# Altium schematic sheet uC.SchDoc
size A3; SheetNumber: 2; SheetTotal: 4
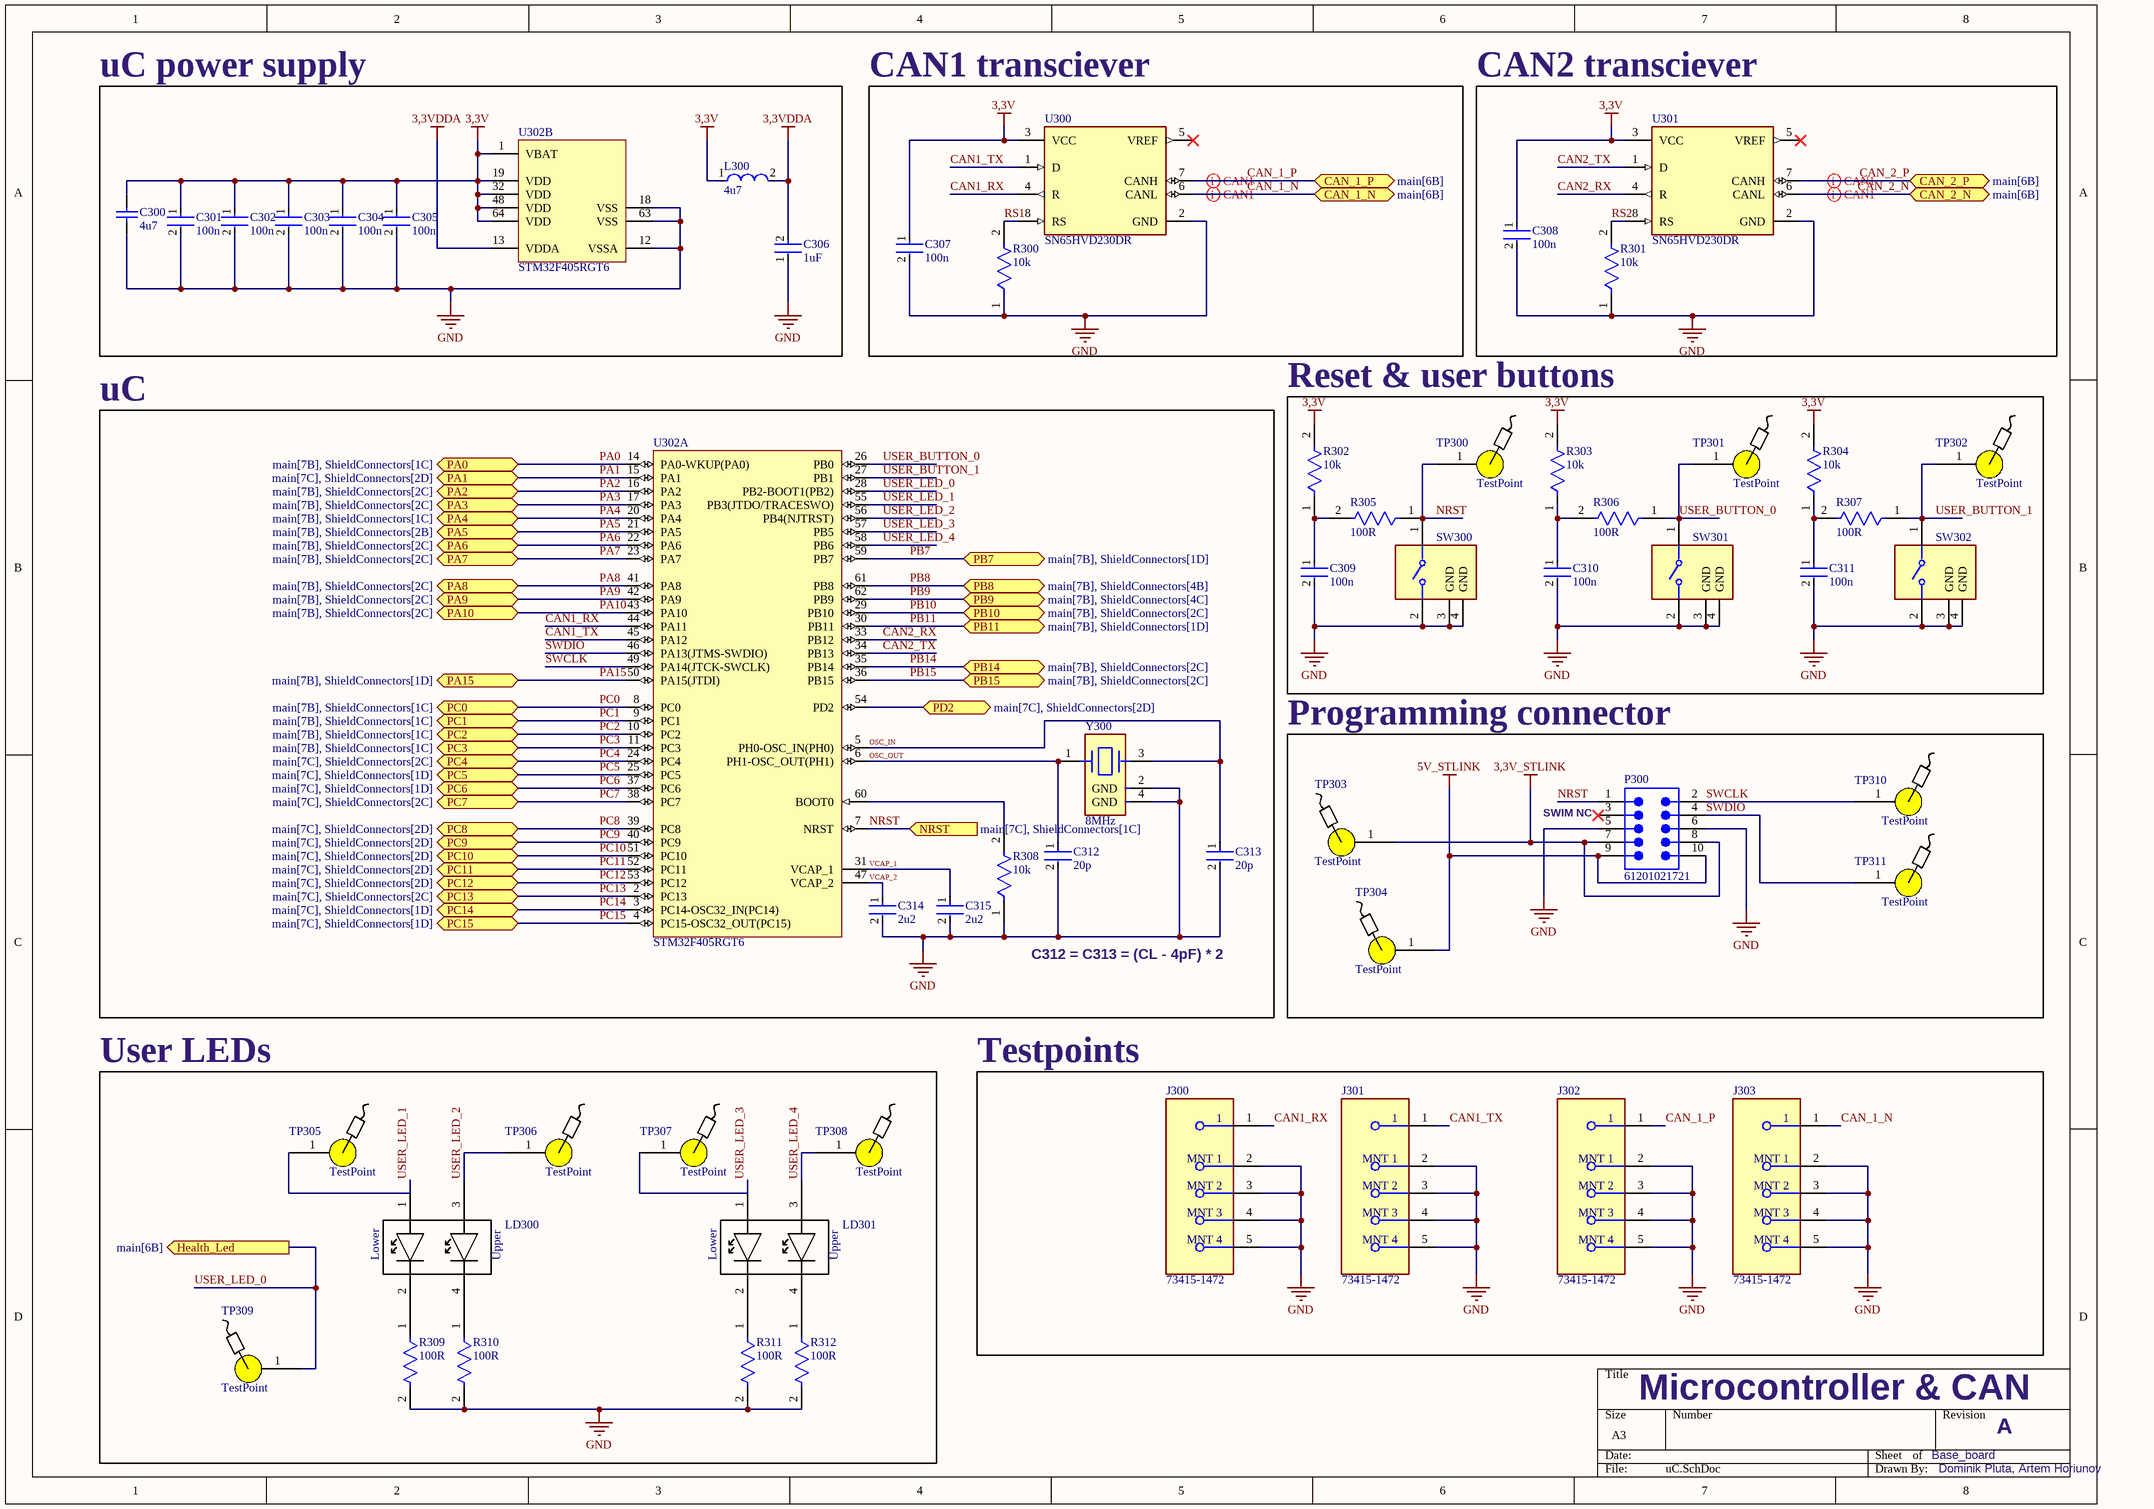
[diagram p0: uC.SchDoc]

## Parts
C300  4u7  [CAPC1608X87X35NL15T15]
C301  100n  [FP-C0603C-CF-MFG]
C302  100n  [FP-C0603C-CF-MFG]
C303  100n  [FP-C0603C-CF-MFG]
C304  100n  [FP-C0603C-CF-MFG]
C305  100n  [FP-C0603C-CF-MFG]
C306  1uF  [FP-C1608-080-0_1-IPC_B]
C307  100n  [FP-C0603C-CF-MFG]
C308  100n  [FP-C0603C-CF-MFG]
C309  100n  [FP-C0603C-CF-MFG]
C310  100n  [FP-C0603C-CF-MFG]
C311  100n  [FP-C0603C-CF-MFG]
C312  20p  [FP-C0603C-CF-MFG]
C313  20p  [FP-C0603C-CF-MFG]
C314  2u2  [FP-GRM188-0_1-e0_2_0_5-MFG]
C315  2u2  [FP-GRM188-0_1-e0_2_0_5-MFG]
J300  73415-1472  [FP-73415-1472-MFG]
J301  73415-1472  [FP-73415-1472-MFG]
J302  73415-1472  [FP-73415-1472-MFG]
J303  73415-1472  [FP-73415-1472-MFG]
L300  4u7  [FP-LQM21DH_70-IPC_C]
LD300  (no value)  [LED_HOLDER]
LD301  (no value)  [LED_HOLDER]
P300  61201021721  [61201021721]
R300  10k  [FP-RC0603-0_55-IPC_C]
R301  10k  [FP-RC0603-0_55-IPC_C]
R302  10k  [FP-RC0603-0_55-IPC_C]
R303  10k  [FP-RC0603-0_55-IPC_C]
R304  10k  [FP-RC0603-0_55-IPC_C]
R305  100R  [FP-RC0603-0_55-MFG]
R306  100R  [FP-RC0603-0_55-MFG]
R307  100R  [FP-RC0603-0_55-MFG]
R308  10k  [FP-RC0603-0_55-IPC_C]
R309  100R  [FP-RC0603-0_55-MFG]
R310  100R  [FP-RC0603-0_55-MFG]
R311  100R  [FP-RC0603-0_55-MFG]
R312  100R  [FP-RC0603-0_55-MFG]
SW300  B3F-3122  [FP-B3F-3122-MFG]  (value not drawn)
SW301  B3F-3122  [FP-B3F-3122-MFG]  (value not drawn)
SW302  B3F-3122  [FP-B3F-3122-MFG]  (value not drawn)
TP300  TestPoint  [TestPoint]  (no BOM)
TP301  TestPoint  [TestPoint]  (no BOM)
TP302  TestPoint  [TestPoint]  (no BOM)
TP303  TestPoint  [TestPoint]  (no BOM)
TP304  TestPoint  [TestPoint]  (no BOM)
TP305  TestPoint  [TestPoint]  (no BOM)
TP306  TestPoint  [TestPoint]  (no BOM)
TP307  TestPoint  [TestPoint]  (no BOM)
TP308  TestPoint  [TestPoint]  (no BOM)
TP309  TestPoint  [TestPoint]  (no BOM)
TP310  TestPoint  [TestPoint]  (no BOM)
TP311  TestPoint  [TestPoint]  (no BOM)
U300  SN65HVD230DR  [FP-D0008A-IPC_A]
U301  SN65HVD230DR  [FP-D0008A-IPC_A]
U302  STM32F405RGT6  [STM-LQFP64_M]  (parts A,B of 2)
Y300  8MHz  [FP-7M-MFG]

## Blocks framed on the sheet
uC power supply: C300-C306 L300 U302
CAN1 transciever: C307 R300 U300
CAN2 transciever: C308 R301 U301
uC: C312-C315 R308 U302 Y300
Reset & user buttons: C309-C311 R302-R307 SW300-SW302 TP300-TP302
Programming connector: P300 TP303 TP304 TP310 TP311
User LEDs: LD300 LD301 R309-R312 TP305-TP309
Testpoints: J300-J303

## Ports
CAN_1_N (bidir, see main[6B]), CAN_1_P (bidir, see main[6B]), CAN_2_N (bidir, see main[6B]), CAN_2_P (bidir, see main[6B]), Health_Led (out, see main[6B]), NRST (in, see main[7C], ShieldConnectors[1C]), PA0 (bidir, see main[7B], ShieldConnectors[1C]), PA1 (bidir, see main[7C], ShieldConnectors[2D]), PA2 (bidir, see main[7B], ShieldConnectors[2C]), PA3 (bidir, see main[7B], ShieldConnectors[2C]), PA4 (bidir, see main[7B], ShieldConnectors[1C]), PA5 (bidir, see main[7B], ShieldConnectors[2B]), PA6 (bidir, see main[7B], ShieldConnectors[2C]), PA7 (bidir, see main[7B], ShieldConnectors[2C]), PA8 (bidir, see main[7B], ShieldConnectors[2C]), PA9 (bidir, see main[7B], ShieldConnectors[2C]), PA10 (bidir, see main[7B], ShieldConnectors[2C]), PA15 (bidir, see main[7B], ShieldConnectors[1D]), PB7 (bidir, see main[7B], ShieldConnectors[1D]), PB8 (bidir, see main[7B], ShieldConnectors[4B]), PB9 (bidir, see main[7B], ShieldConnectors[4C]), PB10 (bidir, see main[7B], ShieldConnectors[2C]), PB11 (bidir, see main[7B], ShieldConnectors[1D]), PB14 (bidir, see main[7B], ShieldConnectors[2C]), PB15 (bidir, see main[7B], ShieldConnectors[2C]), PC0 (bidir, see main[7B], ShieldConnectors[1C]), PC1 (bidir, see main[7B], ShieldConnectors[1C]), PC2 (bidir, see main[7B], ShieldConnectors[1C]), PC3 (bidir, see main[7B], ShieldConnectors[1C]), PC4 (bidir, see main[7C], ShieldConnectors[2C]), PC5 (bidir, see main[7C], ShieldConnectors[1D]), PC6 (bidir, see main[7C], ShieldConnectors[1D]), PC7 (bidir, see main[7C], ShieldConnectors[2C]), PC8 (bidir, see main[7C], ShieldConnectors[2D]), PC9 (bidir, see main[7C], ShieldConnectors[2D]), PC10 (bidir, see main[7C], ShieldConnectors[2D]), PC11 (bidir, see main[7C], ShieldConnectors[2D]), PC12 (bidir, see main[7C], ShieldConnectors[2D]), PC13 (bidir, see main[7C], ShieldConnectors[2C]), PC14 (bidir, see main[7C], ShieldConnectors[1D]), PC15 (bidir, see main[7C], ShieldConnectors[1D]), PD2 (bidir, see main[7C], ShieldConnectors[2D])

## Nets
3,3V: C300.2 C301.1 C302.1 C303.1 C304.1 C305.1 C307.1 C308.1 L300.1 R302.2 R303.2 R304.2 U300.3(VCC) U301.3(VCC) U302.1(VBAT) U302.19(VDD) U302.32(VDD) U302.48(VDD) U302.64(VDD)
3,3V_STLINK: P300.7 P300.8 TP303.1
3,3VDDA: C306.2 L300.2 U302.13(VDDA)
5V_STLINK: P300.9 P300.10 TP304.1
GND: C300.1 C301.2 C302.2 C303.2 C304.2 C305.2 C306.1 C307.2 C308.2 C309.2 C310.2 C311.2 C312.2 C313.2 C314.2 C315.2 J300.2(MNT_1) J300.3(MNT_2) J300.4(MNT_3) J300.5(MNT_4) J301.2(MNT_1) J301.3(MNT_2) J301.4(MNT_3) J301.5(MNT_4) J302.2(MNT_1) J302.3(MNT_2) J302.4(MNT_3) J302.5(MNT_4) J303.2(MNT_1) J303.3(MNT_2) J303.4(MNT_3) J303.5(MNT_4) P300.5 P300.6 R300.1 R301.1 R308.1 R309.2 R310.2 R311.2 R312.2 SW300.2 SW300.3(GND) SW300.4(GND) SW301.2 SW301.3(GND) SW301.4(GND) SW302.2 SW302.3(GND) SW302.4(GND) U300.2(GND) U301.2(GND) U302.12(VSSA) U302.18(VSS) U302.63(VSS) Y300.2(GND) Y300.4(GND)
CAN1_RX: J300.1 U300.4(R) U302.44(PA11)
CAN1_TX: J301.1 U300.1(D) U302.45(PA12)
CAN2_RX: U301.4(R) U302.33(PB12)
CAN2_TX: U301.1(D) U302.34(PB13)
CAN_1_N: J303.1 U300.6(CANL) ; port CAN_1_N
CAN_1_P: J302.1 U300.7(CANH) ; port CAN_1_P
CAN_2_N: U301.6(CANL) ; port CAN_2_N
CAN_2_P: U301.7(CANH) ; port CAN_2_P
NRST: P300.1 R305.1 SW300.1 TP300.1 U302.7(NRST) ; port NRST
OSC_IN: C313.1 U302.5(PH0-OSC_IN(PH0)) Y300.3
OSC_OUT: C312.1 U302.6(PH1-OSC_OUT(PH1)) Y300.1
PA0: U302.14(PA0-WKUP(PA0)) ; port PA0
PA1: U302.15(PA1) ; port PA1
PA2: U302.16(PA2) ; port PA2
PA3: U302.17(PA3) ; port PA3
PA4: U302.20(PA4) ; port PA4
PA5: U302.21(PA5) ; port PA5
PA6: U302.22(PA6) ; port PA6
PA7: U302.23(PA7) ; port PA7
PA8: U302.41(PA8) ; port PA8
PA9: U302.42(PA9) ; port PA9
PA10: U302.43(PA10) ; port PA10
PA15: U302.50(PA15(JTDI)) ; port PA15
PB7: U302.59(PB7) ; port PB7
PB8: U302.61(PB8) ; port PB8
PB9: U302.62(PB9) ; port PB9
PB10: U302.29(PB10) ; port PB10
PB11: U302.30(PB11) ; port PB11
PB14: U302.35(PB14) ; port PB14
PB15: U302.36(PB15) ; port PB15
PC0: U302.8(PC0) ; port PC0
PC1: U302.9(PC1) ; port PC1
PC2: U302.10(PC2) ; port PC2
PC3: U302.11(PC3) ; port PC3
PC4: U302.24(PC4) ; port PC4
PC5: U302.25(PC5) ; port PC5
PC6: U302.37(PC6) ; port PC6
PC7: U302.38(PC7) ; port PC7
PC8: U302.39(PC8) ; port PC8
PC9: U302.40(PC9) ; port PC9
PC10: U302.51(PC10) ; port PC10
PC11: U302.52(PC11) ; port PC11
PC12: U302.53(PC12) ; port PC12
PC13: U302.2(PC13) ; port PC13
PC14: U302.3(PC14-OSC32_IN(PC14)) ; port PC14
PC15: U302.4(PC15-OSC32_OUT(PC15)) ; port PC15
PD2: U302.54(PD2) ; port PD2
RS1: R300.2 U300.8(RS)
RS2: R301.2 U301.8(RS)
SWCLK: P300.2 TP310.1 U302.49(PA14(JTCK-SWCLK))
SWDIO: P300.4 TP311.1 U302.46(PA13(JTMS-SWDIO))
USER_BUTTON_0: R306.1 SW301.1 TP301.1 U302.26(PB0)
USER_BUTTON_1: R307.1 SW302.1 TP302.1 U302.27(PB1)
USER_LED_0: TP309.1 U302.28(PB2-BOOT1(PB2)) ; port Health_Led
USER_LED_1: LD300.1 TP305.1 U302.55(PB3(JTDO/TRACESWO))
USER_LED_2: LD300.3 TP306.1 U302.56(PB4(NJTRST))
USER_LED_3: LD301.1 TP307.1 U302.57(PB5)
USER_LED_4: LD301.3 TP308.1 U302.58(PB6)
VCAP_1: C315.1 U302.31(VCAP_1)
VCAP_2: C314.1 U302.47(VCAP_2)
NetC309_1: C309.1 R302.1 R305.2
NetC310_1: C310.1 R303.1 R306.2
NetC311_1: C311.1 R304.1 R307.2
NetLD300_2: LD300.2 R309.1
NetLD300_4: LD300.4 R310.1
NetLD301_2: LD301.2 R311.1
NetLD301_4: LD301.4 R312.1
NetR308_2: R308.2 U302.60(BOOT0)

Not connected (* = marked no-connect by the designer): P300 3*; U300 5(VREF)*; U301 5(VREF)*

## Layout directives
differential pair: CAN_1_N, CAN_1_P, CAN_2_N, CAN_2_P

## Notes on the sheet
- (near P300) SWIM NC
- C312 = C313 = (CL - 4pF) * 2
- Microcontroller & CAN
- Base_board
- A
- Dominik Pluta, Artem Horiunov
- (in symbol DoubleStack_Side_Led_3mm) Lower; Upper

## Library data of the parts
C300 = CMP-2006-03238-1: Part Number: C0603C475K8PACTU; Manufacturer: Kemet
C301-C305 C307-C311 = CMP-2006-03061-2: CAP CER 0.1UF 50V X7R 0603; Manufacturer: KEMET; Manufacturer Part Number: C0603C104K5RACTU; Tolerance: 0.1; Temperature Coefficient: 30ppm/°C; Material: Ceramic; Automotive Grade: Grade 1; Value: 0.10 μF; Temperature: -55°C to +125°C; RoHS: TRUE; Temperature Range High: +125°C; Lead Free: Yes; Octopart: https://octopart.com/c0603c104k5ractu-kemet-139244; Digikey Description: CAP CER 0.1UF 50V X7R 0603; Category: Cap; Package: C0603C-CF; ComponentLink2Description: Datasheet; Temperature Range Low: -55°C; Device Class L1: Passive Components; Voltage Rating: 50 V; Automotive: Yes; Device Class L3: Ceramic Capacitors; ComponentLink2URL: https://api.kemet.com/component-edge/download/datasheet/C0603C100J5GACAUTO.pdf; Capacitance: 0.10 μF; Device Class L2: Capacitors; Temperature Characteristic: X7R; Height: 0.87mm
C306 = CMP-2000-06025-2: Multilayer Ceramic Capacitors 1μF ±10% 50V X5R SMD 0603; Lead Free: Lead Free; Height: 0.8mm; Mount: Surface Mount; Radiation Hardening: No; Thickness: 0.035inch; Length: 1.6mm; Max Operating Temperature: 85°C; REACH SVHC: No SVHC; Min Operating Temperature: -55°C; Construction: Flat; RoHS Compliant: Yes; Voltage Rating: 50V; Dielectric: X5R; Packaging: Tape and Reel; Termination: SMD/SMT; Voltage Rating (DC): 50V; Case Code (Imperial): 0603; Voltage: 50V; Width: 0.031inch; Weight: 7.1E-05oz; Capacitance: 1uF; Depth: 0.8mm; Case Code (Metric): 1608; Series: C; Case/Package: 0603; Tolerance: 10%; Resistor Type: Ceramic; Number of Pins: 2; Dielectric Material: Ceramic; Package Quantity: 1
C312 C313 = CMP-1035-00783-3: CAP CER 20PF 50V 5% NP0 0603; Manufacturer Part Number: C0603C200J5GACTU; Manufacturer: KEMET; Temperature Coefficient: 30ppm/°C; Temperature Characteristic: C0G; Automotive Grade: Grade 1; Tolerance: 0.05; Material: Ceramic; Category: Cap; Temperature Range Low: -55°C; RoHS: TRUE; ComponentLink2URL: https://api.kemet.com/component-edge/download/datasheet/C0603C100J5GACAUTO.pdf; Package: C0603C-CF; Height: 0.87mm; Capacitance: 20 pF; Voltage Rating: 50 V; Octopart: https://octopart.com/c0603c200j5gactu-kemet-9138585; Device Class L1: Passive Components; Automotive: Yes; Digikey Description: CAP CER 20PF 50V 5% NP0 0603; Temperature Range High: +125°C; Device Class L3: Ceramic Capacitors; Mouser Description: Multilayer Ceramic Capacitors MLCC - SMD/SMT 50volts 20pF C0G 5%; ComponentLink2Description: Datasheet; Device Class L2: Capacitors; Lead Free: Yes; Temperature: -55°C to +125°C; Value: 20 pF
C314 C315 = CMP-2006-02836-2: Chip Multilayer Ceramic Capacitors for General Purpose, 0603, 2.2uF, X7R, 15%, 10%, 10V; Case Code (Metric): 1608; Height: 0.8mm; Packaging: Cut Tape; Voltage: 10V; Lead Free: Lead Free; Min Operating Temperature: -55°C; Voltage Rating (DC): 10V; Max Operating Temperature: 125°C; Voltage Rating: 10V; Dielectric: X7R; Depth: 0.8mm; Case Code (Imperial): 0603; Termination: SMD/SMT; Case/Package: 0603; Number of Pins: 2; REACH SVHC: No SVHC; Mount: Surface Mount; Width: 0.031inch; Material: Ceramic; Capacitance: 2.2uF; Package Quantity: 1; Weight: 7.1E-05oz; Length: 1.6mm; Thickness: 0.035inch; Tolerance: 10%
J300-J303 = CMP-00257-24916978-1: 73415-1472 50 Ohms, MMCX Vertical Jack, PCB, Brass and Gold Per Commercial Requirements, One Piece Per Bag; Manufacturer Lifecycle Status: ACTIVE; Dielectric Material: Teflon; Number of Contacts: 1; Resistance: 50Ω; Voltage Rating: 170V; Frequency: 6GHz; Orientation: Straight; Min Operating Temperature: -55°C; Height: 4.55mm; Max Operating Temperature: 165°C; Country of Origin: TW; Lifecycle Status: Production; Packaging: Bulk; Halogen Free: Low Halogen; NexarPartId: 24916978; RoHS: Non-Compliant; Contact Material: Gold; Impedance: 50Ω; Mount: Through Hole
L300 = CMP-06042-016801-1: Multilayer Type Inductor for General Circuits, 0805 (2012), 22μH, 30%, 0.65Ω, 13mA; Shielding: Shielded; Inductance Tolerance: 10%; Core Material: Ferrite; DC Resistance (DCR): 1R; Test Frequency: 10MHz; Current Rating: 30mA; Inductance: 4.7uH; Self Resonant Frequency: 47MHz; Q Factor: 45; Packaging: Tape and Reel; Width: 1.25mm; Package Quantity: 1; REACH SVHC: No SVHC; Min Operating Temperature: -40°C; Tolerance: 10%; Lead Free: Lead Free; Depth: 1.45mm; Termination: SMD/SMT; Case Code (Imperial): 0805; Case Code (Metric): 2012; Rated Current-Max: 30mA; Military Standard: Not; Length: 2mm; Series: LQM21N; Case/Package: 0805; Max DC Current: 30mA; DC Current: 30mA; Mount: Surface Mount; Height: 0.85mm; Max Operating Temperature: 85°C; Radiation Hardening: No
LD300 LD301 = DoubleStack_Side_Led_3mm
P300 = CMP-1502-00021-2: NexarPartId: 8917787; Operating Supply Voltage: 250V; Number of Positions: 10; Contact Resistance: 20mΩ; Connector Type: Male Pin; Current Rating: 3A; Pitch: 2.54mm; Gender: Male; Insulation Resistance: 1GΩ; Insulation: Insulated; Max Operating Temperature: 105°C; Flammability Rating: UL94 V-0; Mount: Through Hole; Contact Material: Copper; Min Operating Temperature: -40°C; Length: 20.36mm; Number of Contacts: 10; Height: 8.85mm; Number of Rows: 2; Housing Material: PBT; Color: Black; Contact Gender: Male; Orientation: Right Angle; Contact Plating: Gold; Number of Pins: 10; Voltage Rating (DC): 250V; RoHS: Compliant; Insulation Material: PBT; REACH SVHC: Unknown; Row Spacing: 2.54mm; Voltage Rating: 250V; Width: 20.36mm; Lead Pitch: 2.54mm; Termination: Through Hole
R300-R304 R308 = CMP-2100-03664-2: RES 10K OHM 1% 1/10W 0603; Voltage Rating: 75V; Voltage Rating (DC): 50V; Resistance: 10kR; Power Rating: 100mW; Temperature Coefficient: 100ppm/°C; Depth: 0.8mm; Termination: SMD/SMT; Resistor Type: Thick Film; Series: RC; Construction: Rectangular; Features: Moisture Resistant; Packaging: Tape and Reel; Min Operating Temperature: -55°C; Number of Terminations: 2; Lead Pitch: 0.3mm; RoHS Compliant: Yes; Case/Package: 0603; Resistance Tolerance: 1%; Military Standard: Not; Weight: 7.1E-05oz; Number of Pins: 2; Tolerance: 1%; Length: 1.6mm; Case Code (Imperial): 0603; Lead Free: Lead Free; Width: 0.8mm; Max Power Dissipation: 100mW; Height: 0.45mm; Max Operating Temperature: 155°C; Case Code (Metric): 1608; Size Code: 0603
R305-R307 R309-R312 = CMP-2100-03663-2: NexarPartId: 55402879; Voltage Rating: 50V; Power Rating: 100mW; Tolerance: 1%; Temperature Coefficient: 100ppm/°C; Resistance: 100Ω; Case/Package: 0603; Military Standard: Not; REACH SVHC: Unknown; Case Code (Metric): 0603; Max Operating Temperature: 155°C; Schedule B: 8533210045, 8533210045; Height: 450µm; Length: 1.6mm; Lead Free: Lead Free; Packaging: Tape & Reel; Case Code (Imperial): 0603; Composition: Thick Film; Min Operating Temperature: -55°C; Voltage Rating (DC): 50V; RoHS: Compliant; Depth: 800µm; Number of Pins: 2; Termination: SMD/SMT; Width: 800µm
SW300-SW302 = CMP-08834-000053-1: SWITCH TACTILE SPST-NO 0.05A 24V; Max Current Rating: 50mA; Actuator Type: Standard; Ratings: IP00; Number of Poles: 1; Mechanical Life: 300000Cycles; Illumination Type: Non-Illuminated; Switch Function: Off-Mom; Actuator Color: Grey; Contact Resistance: 100mR; Throw Configuration: SPST; Actuator Length: 1.6mm; Switch Travel: 0.25mm; Operating Force: 1.47N; Weight: 0.25g; Voltage Rating (DC): 24V; Contact Plating: Gold; RoHS Compliant: Yes; Contact Material: Gold; Radiation Hardening: No; Packaging: Bulk; Height: 7.4mm; Min Operating Temperature: -25°C; Electrical Life: 300000Cycles; Depth: 7.85mm; Max Voltage Rating (DC): 24V; Mount: Through Hole; Width: 6.25mm; Current Rating: 50mA; Lead Free: Lead Free; Max Operating Temperature: 70°C; Series: B3F; Contact Current Rating: 50mA; Package Quantity: 1000; Termination: PC Pins; Orientation: Right Angle; Length: 7.3mm
U300 U301 = CMP-0315-00015-3: IC TRANSCEIVER HALF 1/1 8SOIC; Number of Transceivers: 1; Operating Supply Voltage: 3.3V; Number of I/Os: 2; Max Supply Current: 17mA; Max Supply Voltage: 3.6V; Min Supply Voltage: 3V; Data Rate: 1Mbps; Min Operating Temperature: -40°C; Packaging: Tape and Reel; Lead Free: Lead Free; Number of Transmit Buffers: 1; Max Operating Temperature: 85°C; Number of Receive Buffers: 1; Number of Pins: 8; Package Quantity: 1; Radiation Hardening: No; Case/Package: D; REACH SVHC: No SVHC; Weight: 0.002561oz; Termination: SMD/SMT; Contact Plating: Gold; Nominal Supply Current: 17mA; Number of Receivers: 1; Number of Drivers: 1
U302 = CMP-0243-00019-3: ARM Cortex-M4 32-bit MCU+FPU, 210 DMIPS, 1024 kB Flash, 192 kB Internal RAM, 51 I/Os, 64-pin LQFP, -40 to 85 degC, Tray; Manufacturer: STMicroelectronics; Supply Voltage(Vcc) min (V): 1.8; Supply Voltage(Vcc) max (V): 3.6; Internal RAM Size (kB): 192; I/Os (High Current): 51; D/A Converter: 2x12-bit; FLASH Size (Prog) (kB): 1024; Operating Frequency(F) (Processor speed) (MHz): 168; ComponentLink2Description: Datasheet; PackageVersion: Rev. 4, 06/2013; DatasheetVersion: Rev. 4; Core: ARM Cortex-M4; ComponentLink2URL: http://www.st.com/st-web-ui/static/active/en/resource/technical/document/datasheet/DM00037051.pdf; PackageReference: LQFP64; Packing: Tray; ComponentLink1Description: Manufacturer URL; ComponentLink3URL: http://www.st.com/st-web-ui/static/active/en/resource/technical/document/datasheet/DM00037051.pdf; ComponentLink3Description: Package Specification; Mounting Technology: Surface Mount; ComponentLink1URL: http://www.st.com/web/en/home.html; PackageDescription: 64-Pin Low Profile Quad Flat Package, 10 x 10 mm Body, 0.5 mm Pitch; PartNumber: STM32F405RGT6
Y300 = CMP-18717-000311-1: Crystal; ESR (Equivalent Series Resistance): 100R; Frequency: 12MHz; Frequency Stability: 10ppm; Load Capacitance: 10pF; Width: 0.098inch; Number of Pins: 4; Case/Package: SMD/SMT; REACH SVHC: No SVHC; Mount: Surface Mount; Max Operating Temperature: 70°C; RoHS Compliant: Yes; Depth: 2.5mm; Length: 3.2mm; Termination: SMD/SMT; Frequency Tolerance: 10ppm; Min Operating Temperature: -20°C; Series: 7M; Packaging: Tape and Reel; Tolerance: 10ppm; Height: 0.031inch; Package Quantity: 3000